# Altium schematic sheet 1_MC & Peripherals.schdoc
size 302 x 215 mm; Name: A_A4; Symbol: A_A4; Device: A_A4; @Project Name: ESP32-C3 module_2024-02-14_10-07-03; REV: 1.0.1; Date: 2025-07-01; Sheet: 1/2; Draw By: Konstantinos Paraskevas; Company: Konstantinos Paraskevas; Convert to PCB: yes; Add into BOM: yes; @Page No: 1; @Page Count: 2; @Schematic Name: Sprig-C3; @Board Name: Sprig-C3; @Update Date: 2025-12-17; @Create Time: 08:07:06; @Update Time: 20:19:27; @Page Name: MC & Peripherals; @Create Date: 2024-02-14
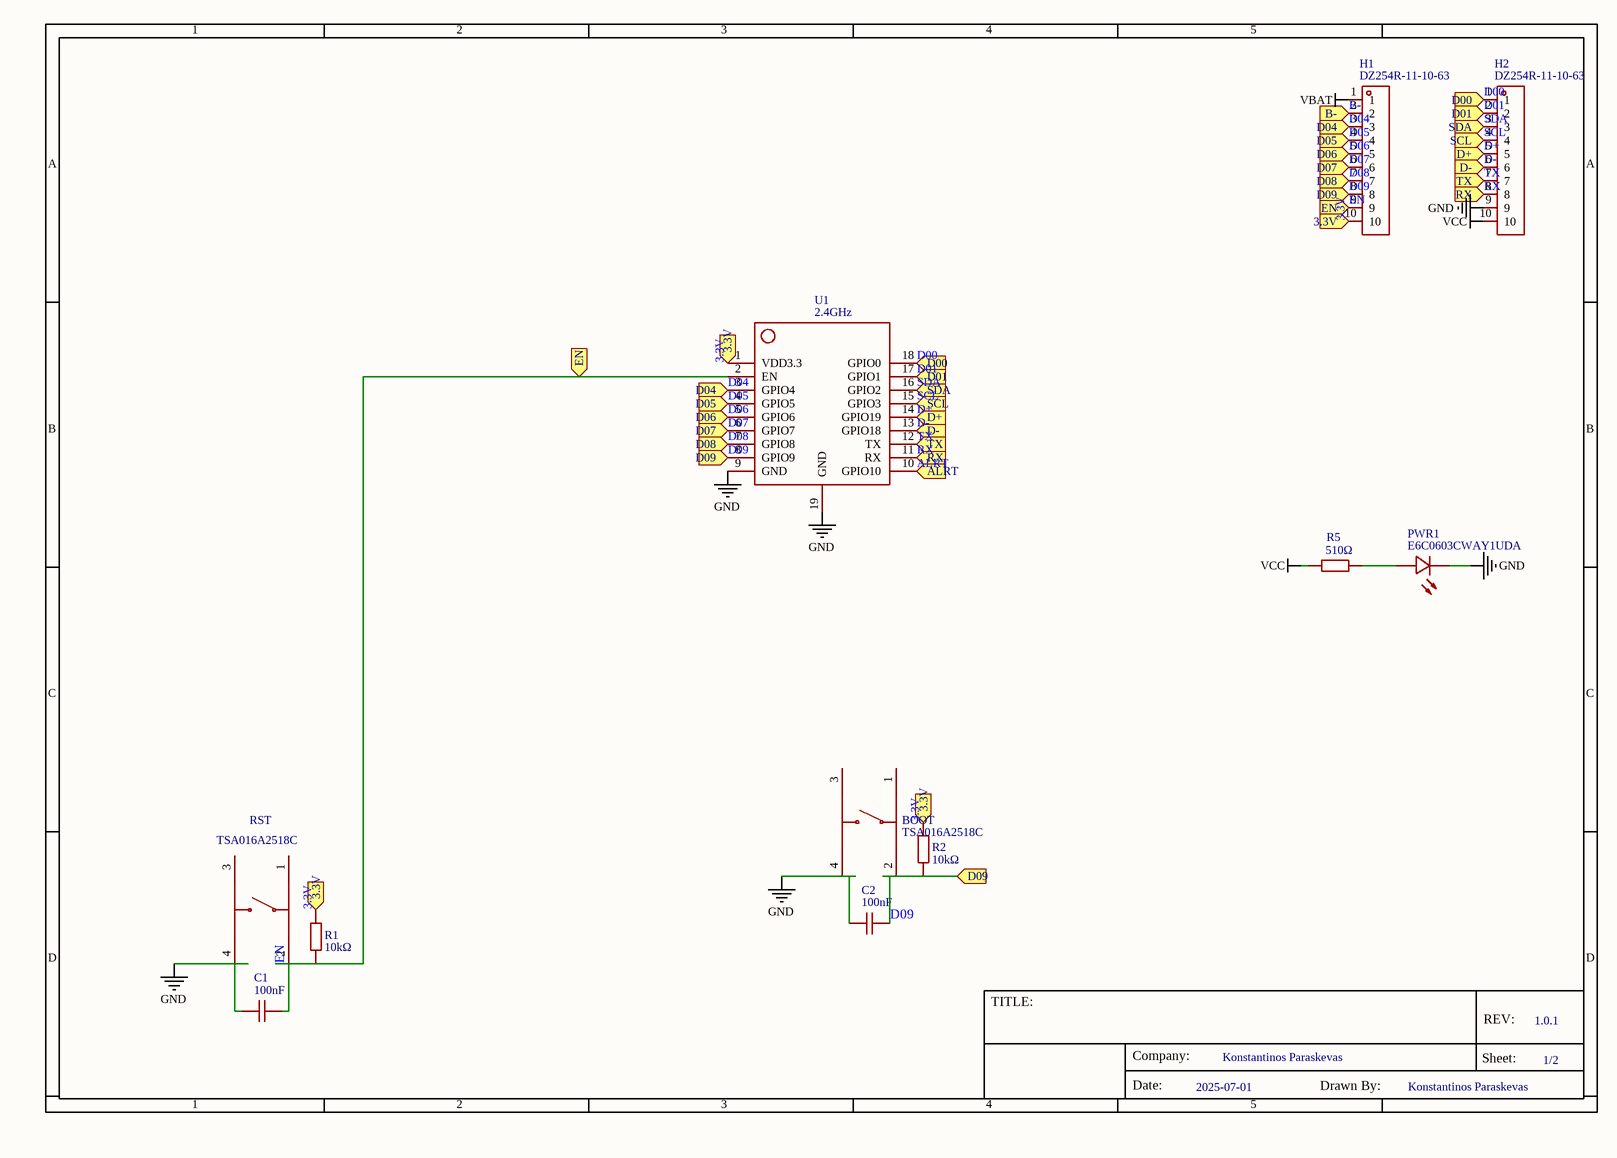
[diagram p0: 1_MC & Peripherals.schdoc]

## Parts
BOOT  TSA016A2518C  [SW-SMD_4P-L4.2-W3.3-P2.15-LS4.6]
C1  100nF  [C0402]
C2  100nF  [C0402]
H1  DZ254R-11-10-63  [HDR-TH_10P-P2.54-V-M]
H2  DZ254R-11-10-63  [HDR-TH_10P-P2.54-V-M]
PWR1  E6C0603CWAY1UDA  [LED0603-R-RD_WHITE]
R1  10kΩ  [R0402]
R2  10kΩ  [R0402]
R5  510Ω  [R0402]
RST  TSA016A2518C  [SW-SMD_4P-L4.2-W3.3-P2.15-LS4.6]
U1  2.4GHz  [BULETM-SMD_ESPRESSIF_ESP32-C3-WROOM-02-N4-4MB]

## Ports
3.3V (in), ALRT (in), B- (in), D00 (in), D01 (in), D04 (in), D05 (in), D06 (in), D07 (in), D08 (in), D09 (in), D+ (in), D- (in), EN (in), RX (in), SCL (in), SDA (in), TX (in)

## Nets
GND: BOOT.4 C1.1 C2.1 H2.9 PWR1.2(-) RST.4 U1.9(GND) U1.19(GND)
VBAT: H1.1
VCC: H2.10 R5.1
3.3V: H1.10 R1.2 R2.2 U1.1(VDD3.3) ; port 3.3V
ALRT: U1.10(GPIO10) ; port ALRT
B-: H1.2 ; port B-
D00: H2.1 U1.18(GPIO0) ; port D00
D01: H2.2 U1.17(GPIO1) ; port D01
D04: H1.3 U1.3(GPIO4) ; port D04
D05: H1.4 U1.4(GPIO5) ; port D05
D06: H1.5 U1.5(GPIO6) ; port D06
D07: H1.6 U1.6(GPIO7) ; port D07
D08: H1.7 U1.7(GPIO8) ; port D08
D09: BOOT.2 C2.2 H1.8 R2.1 U1.8(GPIO9) ; port D09
D+: H2.5 U1.14(GPIO19) ; port D+
D-: H2.6 U1.13(GPIO18) ; port D-
EN: C1.2 H1.9 R1.1 RST.2 U1.2(EN) ; port EN
RX: H2.8 U1.11(RX) ; port RX
SCL: H2.4 U1.15(GPIO3) ; port SCL
SDA: H2.3 U1.16(GPIO2) ; port SDA
TX: H2.7 U1.12(TX) ; port TX
NetPWR1_1: PWR1.1(+) R5.2

Not connected (* = marked no-connect by the designer): BOOT 1 3; RST 1 3

## Notes on the sheet
- 1
- 2
- 3
- 4
- 5
- A
- B
- C
- D
- TITLE:
- REV:
- 1.0.1
- Date:
- Company:
- 2025-07-01
- Konstantinos Paraskevas
- Drawn By:
- Sheet:
- 1/2

## Library data of the parts
BOOT RST = TSA016A2518C: Manufacturer: BZCN(博众电气); Add into BOM: yes; Actuator Style: Oval button; Operating Force: 180gf; Switch Length: 4.2mm; Switch Width: 3.35mm; Switch Height: 2.5mm; Contact Current: 50mA; Voltage Rating (DC): 12V; Actuator/Cap Color: White; Symbol: TSA016A2518C; Device: TSA016A2518C; LCSC Part Name: 4.2*3.35*2.5mm 立贴 轻触开关; Supplier Part: C2888430; Manufacturer Part: TSA016A2518C; Supplier Footprint: SMD; JLCPCB Part Class: Extended Part; Datasheet: https://atta.szlcsc.com/upload/public/pdf/source/20210906/0198B859780D4FA617E4EB862D7350E5.pdf; Supplier: LCSC; Convert to PCB: yes; Mounting Style: Brick nogging; Voltage Rating (AC): -; Mechanical Life: -; Origin Footprint: SW-SMD_4P-L4.2-W3.3-P2.15-LS4.6
C1 C2 = 0402B104K160NT: Manufacturer: FH(风华); Add into BOM: yes; Tolerance: ±10%; Symbol: 100nF; Device: 0402B104K160NT; LCSC Part Name: 100nF ±10% 16V; Supplier Part: C41851; Manufacturer Part: 0402B104K160NT; Supplier Footprint: 0402; JLCPCB Part Class: Extended Part; Datasheet: https://atta.szlcsc.com/upload/public/pdf/source/20200305/C486355_26A10D38EF8C2A5C37091D0039909270.pdf; Supplier: LCSC; Convert to PCB: yes; Value: 100nF; Origin Footprint: C0402
H1 H2 = DZ254R-11-10-63: Manufacturer: DEALON(德艺隆); Convert to PCB: yes; Symbol: DZ254R-11-10-63; Device: DZ254R-11-10-63; Supplier: LCSC; Supplier Part: C2935916; Manufacturer Part: DZ254R-11-10-63; JLCPCB Part Class: Extended Part; Add into BOM: yes; Origin Footprint: HDR-TH_10P-P2.54-V-M
PWR1 = E6C0603CWAY1UDA: Manufacturer: ekinglux(亿晶源); Add into BOM: yes; Emitted Color: White; Lens Color: 雾状黄透镜; Viewing Angle: 120°; Symbol: E6C0603CWAY1UDA; Device: E6C0603CWAY1UDA; LCSC Part Name: 白灯; Supplier Part: C375448; Manufacturer Part: E6C0603CWAY1UDA; Supplier Footprint: 0603; JLCPCB Part Class: Extended Part; Datasheet: https://atta.szlcsc.com/upload/public/pdf/source/20220330/61767F200BF18CBF3CD3534B46D80FD9.pdf; Supplier: LCSC; Convert to PCB: yes; Power Dissipation: -; Forward Current: -; Dominant Wavelength: -; Peak Wavelength: -; Diode Configuration: -; Color Temperature: -; Mounting Sytle: -; Operating Temperature: -40℃~+90℃; Origin Footprint: LED0603-R-RD_WHITE
R1 R2 = RMS04FT1002: Manufacturer: 大毅科技; Add into BOM: yes; Tolerance: ±1%; Temperature Coefficient: ±100ppm/℃; Symbol: 10kΩ; Device: RMS04FT1002; LCSC Part Name: 厚膜电阻 10kΩ ±1% 62.5mW; Supplier Part: C208775; Manufacturer Part: RMS04FT1002; Supplier Footprint: 0402; JLCPCB Part Class: Extended Part; Datasheet: https://atta.szlcsc.com/upload/public/pdf/source/20190313/C209057_DB28D2F9A2E1A0AF6BB7AAA99A28D7CC.pdf; Supplier: LCSC; Convert to PCB: yes; Type: Thick Film Resistors; Value: 10kΩ; Operating Temperature Range: -55℃~+155℃; Origin Footprint: R0402; link: https://lcsc.com/eda_search?q=C208775&amp;%26type=1&amp;ref=editor
R5 = 0402WGF5100TCE: Manufacturer: UNI-ROYAL(厚声); Symbol: 330; Add into BOM: yes; Tolerance: ±1%; Temperature Coefficient: ±100ppm/℃; Device: 0402WGF5100TCE; LCSC Part Name: 510Ω ±1% 62.5mW 厚膜电阻; Supplier Part: C25123; Manufacturer Part: 0402WGF5100TCE; Supplier Footprint: 0402; JLCPCB Part Class: Basic Part; Datasheet: https://atta.szlcsc.com/upload/public/pdf/source/20200306/C422600_1E6D84923E4A46A82E41ADD87F860B5C.pdf; Supplier: LCSC; Convert to PCB: yes; Type: Thick Film Resistors; Value: 510Ω; Operating Temperature Range: -55℃~+155℃; Origin Footprint: R0402
U1 = ESP32-C3-WROOM-02-N4_C2934560: Manufacturer: ESPRESSIF(乐鑫); Symbol: ESP32-­C3­-WROOM­-02; Add into BOM: yes; Core Processor: ESP32-C3芯片; Support Interface: I2C；GPIO；SPI；JTAG；UART；USB；I2S; Output Power: 20.5dBm; Origin Footprint: FOOTPRINT-ESP32-C3-WROOM-02; Device: ESP32-C3-WROOM-02-N4_C2934560; LCSC Part Name: ESP32-C3-WROOM-02-N4; Supplier Part: C2934560; Manufacturer Part: ESP32-C3-WROOM-02-N4; Supplier Footprint: VFQFN-32-EP; JLCPCB Part Class: Extended Part; Datasheet: https://atta.szlcsc.com/upload/public/pdf/source/20220106/F07459EFFE1D7CBA94B4FB8A075146A6.pdf; Supplier: LCSC; Convert to PCB: yes; Value: 2.4GHz; link: https://www.digikey.ca/en/products/detail/espressif-systems/ESP32-C3-WROOM-02-N4/14553031